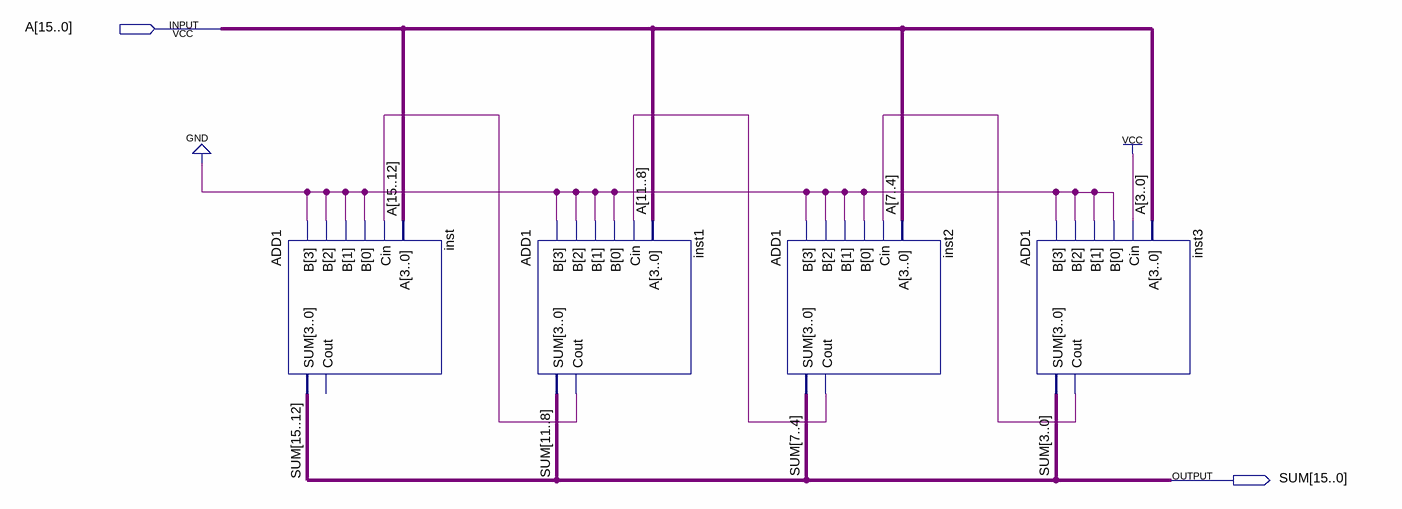
[diagram p0: schematic sheet]
// Quartus schematic 16BITADD1.bdf as structural Verilog: 4 symbols, 2 pins
module \16BITADD1  (
  input  [15:0] A,
  output [15:0] SUM
);

  wire inst1_cout, inst2_cout, inst3_cout;

  ADD1 inst (.B(4'b0000), .Cin(inst1_cout), .A(A[15:12]), .SUM(SUM[15:12]));  // open: Cout
  ADD1 inst1 (.B(4'b0000), .Cin(inst2_cout), .A(A[11:8]), .SUM(SUM[11:8]), .Cout(inst1_cout));
  ADD1 inst2 (.B(4'b0000), .Cin(inst3_cout), .A(A[7:4]), .SUM(SUM[7:4]), .Cout(inst2_cout));
  ADD1 inst3 (.B(4'b0000), .Cin(1'b1), .A(A[3:0]), .SUM(SUM[3:0]), .Cout(inst3_cout));
endmodule
